# Altium schematic sheet ADP151-1V8.SchDoc
size A3
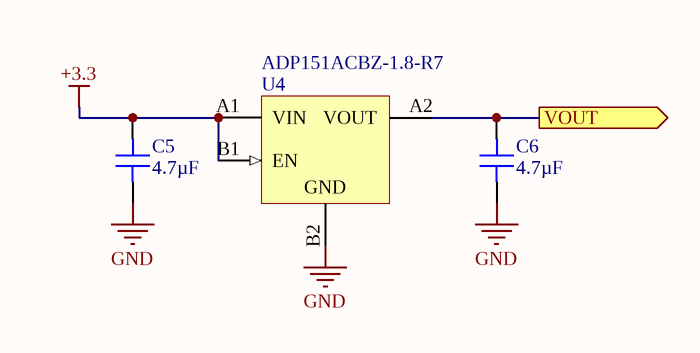
[diagram p0: ADP151-1V8.SchDoc]

## Parts
C5  4.7µF  [CAP 0402_1005]
C6  4.7µF  [CAP 0402_1005]
U4  ADP151ACBZ-1.8-R7  [ADI-CB-4-3]

## Ports
VOUT (out)

## Nets
+3.3: C5.2 U4.A1(VIN) U4.B1(EN)
GND: C5.1 C6.1 U4.B2(GND)
VOUT: C6.2 U4.A2(VOUT) ; port VOUT

## Library data of the parts
C5 C6 = GRM155R61A475MEAAD: CAP CER 4.7UF 10V X5R 0402; Manufacturer: Murata Electronics; Tolerance: ±20%; Part Number: GRM155R61A475MEAAD; Value: 4.7µF; Applications: General Purpose; Capacitance: 4.7µF; ComponentLink1Description: Datasheet; ComponentLink1URL: https://search.murata.co.jp/Ceramy/image/img/A01X/G101/ENG/GRM155R61A475MEAA-01.pdf; ComponentLink2Description: DigiKey Link; ComponentLink2URL: https://www.digikey.com/en/products/detail/murata-electronics/GRM155R61A475MEAAD/6234735; Device Package: 0402 (1005 Metric); LastUpdated: 2/8/2022 12:26:50 PM; Lifecycle Status: Active; Minimum Order: 1; Mounting Type: Surface Mount, MLCC; Operating Temperature: -55°C ~ 85°C; Package / Case: 0402 (1005 Metric); Packaging: TapeAndReel; PartId: 6746; Part Status: Active; Price: 0.03; Series: GRM; Size / Dimension: 0.039" L x 0.020" W (1.00mm x 0.50mm); Supplier 1: DigiKey; Supplier Part Number 1: 490-14306-1-ND; Temperature Coefficient: X5R; Thickness (Max): 0.026" (0.65mm); Voltage - Rated: 10V
U4 = CMP-0786-00016-1: Ultralow Noise, 200 mA, CMOS Linear Regulator, 2.2 to 5.5 V Vin, 1.8 V Vout, Industrial, 4-pin BGA (CB-4-3), Reel; Manufacturer: Analog Devices; Iout max: 200mA; Vin (max) (V): 5.5; Preset Vout Values (V): 1.8; Vin (min) (V): 2.2; Supply Current IGND @ Small Load: 10uA; ComponentLink3Description: Package Specification; Packing: Reel; Mounting Technology: Surface Mount; ComponentLink1Description: Manufacturer URL; PackageReference: CB-4-3; ComponentLink3URL: http:/www.analog.com/static/imported-files/packages/PKG_PDF/WLCSP(CB)/CB_4_3.pdf; ComponentLink4Description: URL Link1; ComponentLink2URL: http://www.analog.com/static/imported-files/data_sheets/ADP151.pdf; PackageVersion: 011409-A, 01/2009; ComponentLink2Description: Datasheet; PartNumber: ADP151ACBZ-1.8-R7; ComponentLink1URL: http://www.analog.com/en/index.html; PackageDescription: 4-Ball Wafer Level Chip Scale Package, Body 0.76 x 0.76 mm, Pitch 0.4 mm; ComponentLink4URL: Product URL:http://www.analog.com/en/ADP151/productSearch.html; DatasheetVersion: Rev. E